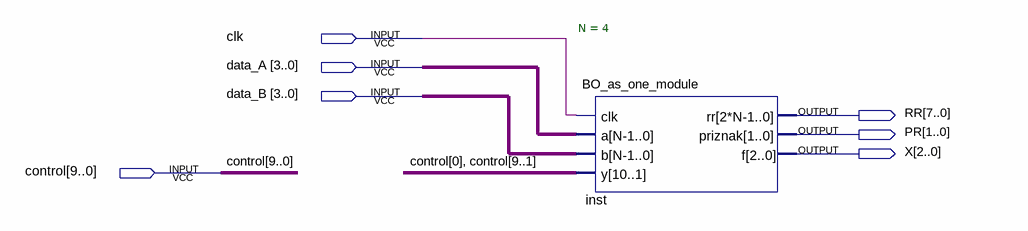
[diagram p0: schematic sheet]
// Quartus schematic test_bo.bdf as structural Verilog: 1 symbols, 7 pins
module test_bo (
  input  clk,
  input  [3:0] data_A,
  input  [3:0] data_B,
  input  [9:0] control,
  output [7:0] RR,
  output [1:0] PR,
  output [2:0] X
);

  BO_as_one_module #(.N(4)) inst (
    .clk(clk), .a(data_A), .b(data_B), .y({control[0], control[9:1]}), .rr(RR), .priznak(PR), .f(X));
endmodule
